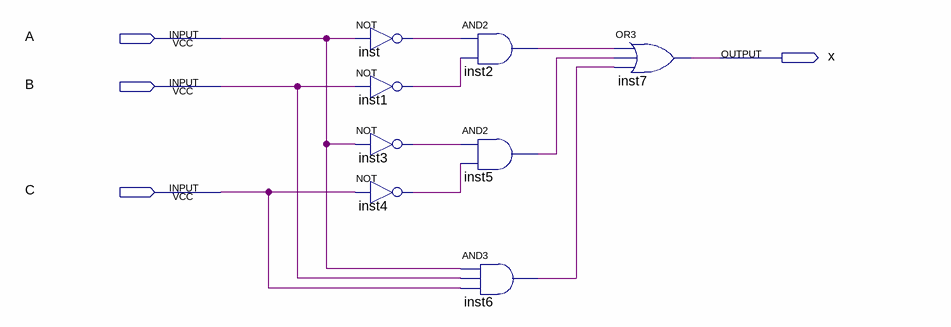
[diagram p0: schematic sheet]
// Quartus schematic diagrama_logico.bdf as structural Verilog: 8 symbols, 4 pins
module diagrama_logico (
  input  A,
  input  B,
  input  C,
  output x
);

  wire inst1_out, inst2_out, inst3_out, inst4_out, inst5_out, inst6_out, inst_out;

  not inst (inst_out, A);
  not inst1 (inst1_out, B);
  not inst3 (inst3_out, A);
  not inst4 (inst4_out, C);
  and inst2 (inst2_out, inst_out, inst1_out);
  and inst5 (inst5_out, inst3_out, inst4_out);
  and inst6 (inst6_out, A, B, C);
  or inst7 (x, inst2_out, inst5_out, inst6_out);
endmodule
